# EAGLE design 2020-10-27 AD590 HIH-4031 (EAGLE 9.6.2)
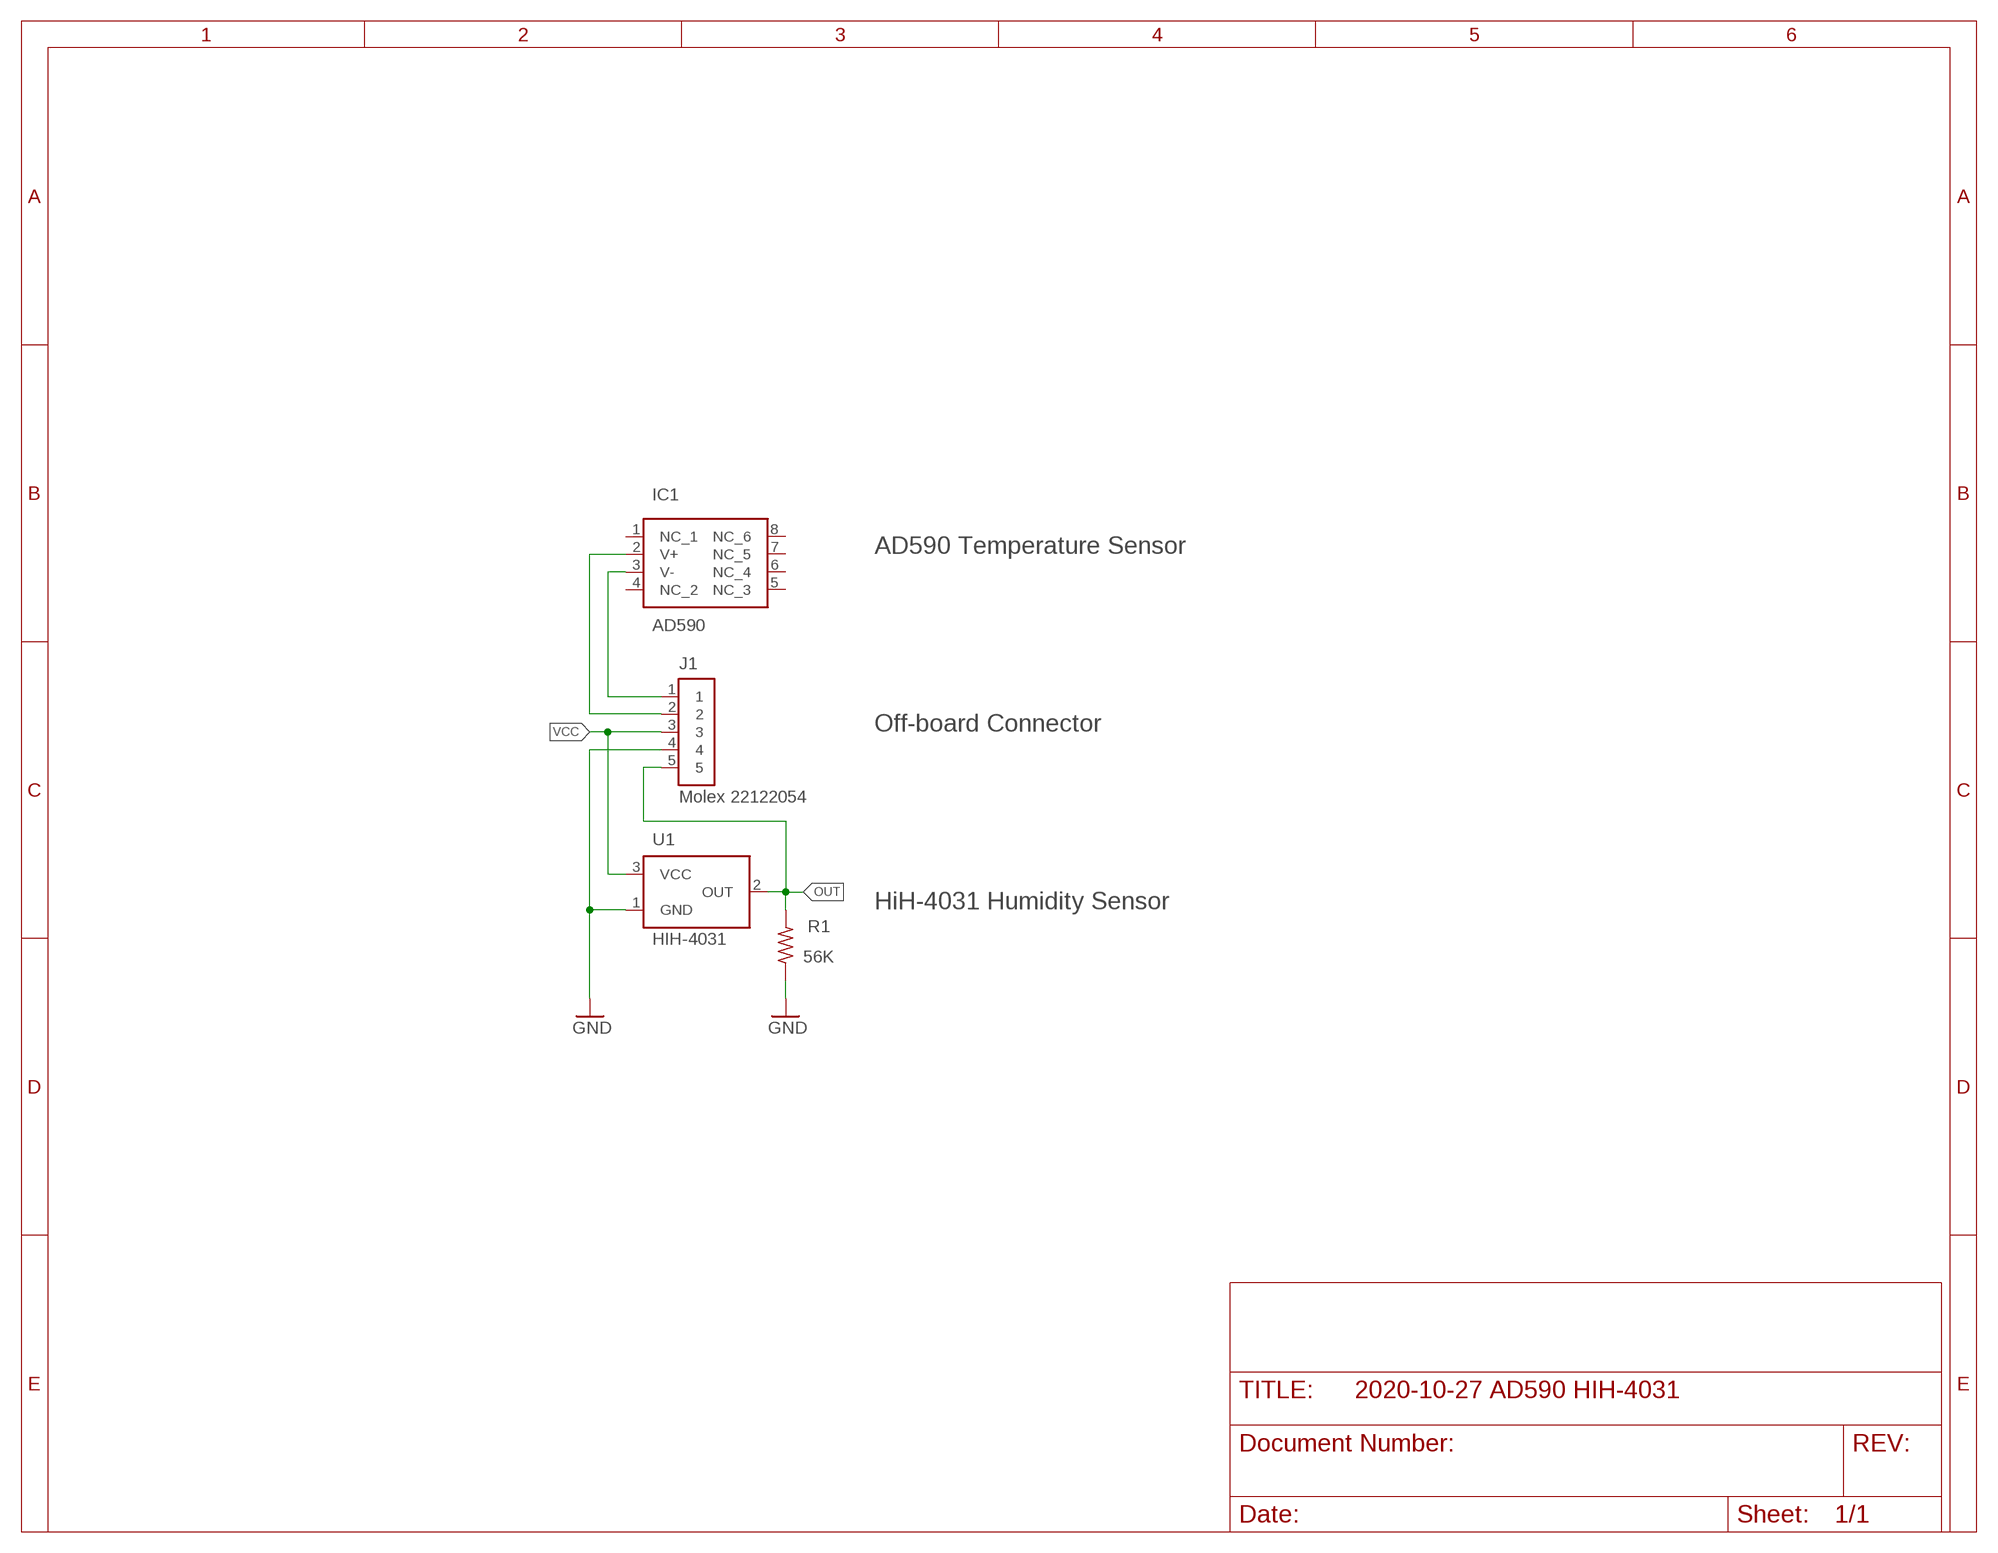
[diagram p0: schematic, sheet 1]

## Parts
IC1  AD590  AD590JRZ  [SOIC127P600X175-8N]
J1  Molex 22122054  PINHD-1X5RA-MOLEX-22122054  [1X05RA-MOLEX-22122054]
R1  56K  R-US_R0805  [R0805]
U1  HIH-4031  HIH-4030  [HIH-4030]

## Nets
GND: J1.4 R1.1 U1.1(GND)
OUT: J1.5 R1.2 U1.2(OUT)
V+: IC1.2(V+) J1.2
V-: IC1.3(V-) J1.1
VCC: J1.3 U1.3(VCC)
Unconnected: IC1.1(NC_1) IC1.4(NC_2) IC1.5(NC_3) IC1.6(NC_4) IC1.7(NC_5) IC1.8(NC_6)

## Notes on the sheet
- AD590 Temperature Sensor
- Off-board Connector
- HiH-4031 Humidity Sensor

## Library data of the parts
IC1 = AUmlib:AD590JRZ: AD590JRZ, Temperature Sensor +/-5C 4 to 30V 8-Pin SOIC Source: Datasheet <http://www.analog.com/static/imported-files/data_sheets/AD590.pdf>; DESCRIPTION: AD590JRZ, Temperature Sensor +/-5C 4 to 30V 8-Pin SOIC; HEIGHT: 1.75mm; MANUFACTURER_NAME: Analog Devices; MANUFACTURER_PART_NUMBER: AD590JRZ; MOUSER_PART_NUMBER: 584-AD590JRZ; MOUSER_PRICE-STOCK: https://www.mouser.com/Search/Refine.aspx?Keyword=584-AD590JRZ; RS_PART_NUMBER: 7096005P; RS_PRICE-STOCK: http://uk.rs-online.com/web/p/products/7096005P
J1 = AUmlib:PINHD-1X5RA-MOLEX-22122054
R1 = AUmlib:R-US_: RESISTOR, American symbol; SPICEPREFIX: R
U1 = AUmlib:HIH-4030: Honeywell HIH-4030 Humidity Sensor - Analog Output The HIH-4030/4031 Series delivers instrumentation-quality RH (Relative Humidity) sensing performance in a competitively priced, solderable SMD. Datasheet <https://www.sparkfun.com/datasheets/Sensors/Weather/SEN-09569-HIH-4030-datasheet.pdf> SparkFun Products SparkFun Humidity Sensor Breakout - HIH-4030 <https://www.sparkfun.com/products/9569> (SEN-09569); PROD_ID: IC-09448

## Board
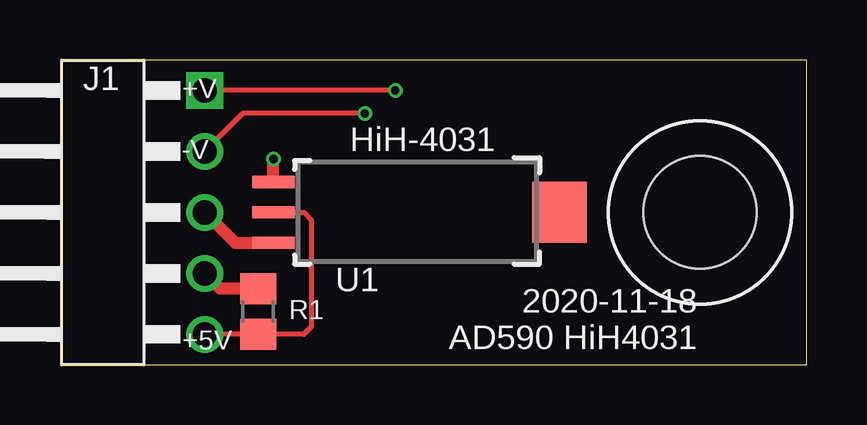
[diagram p1: board, top side]
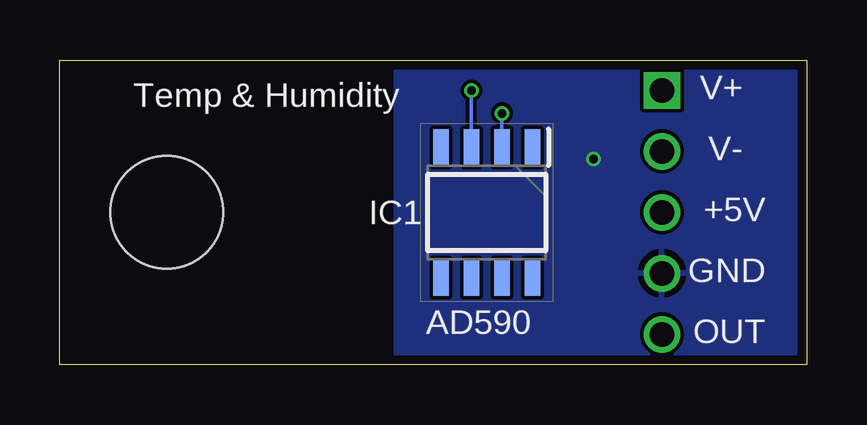
[diagram p2: board, bottom side, seen from below]

Size 31.11 x 12.7 mm. Coordinates in mm from the lower left corner, seen from the top.
Outline: 0,0 31.11,0 31.11,12.7 0,12.7 0,0
Copper layers (1*16): Top 0.035559375mm / dielectric 1.6mm / Bottom 0.035559375mm
Design rules "oshpark-2layer": minimum track width 6mil, minimum drill 10mil, track to track 6mil, track to pad 6mil, pad to pad 6mil, via to via 6mil, smd to smd 6mil, copper to edge 15mil, drill to drill 6mil, minimum pad ring 5mil, minimum via ring 5mil, stop-mask expansion 2.5mil, vias tented up to drill 0mil, thermal gap 10mil
Holes 4.7 mm at 26.67,6.35
bRestrict: area 22.9,2.5 to 30.5,10.2

### Footprints (pad centres in the part's own frame; a part is rotated, then mirrored left to right if it is on the bottom)
SOIC127P600X175-8N = smd 1.525 x 0.65: 1 -2.712,1.905; 2 -2.712,0.635; 3 -2.712,-0.635; 4 -2.712,-1.905; 5 2.712,-1.905; 6 2.712,-0.635; 7 2.712,0.635; 8 2.712,1.905
1X05RA-MOLEX-22122054 = drill 1.016 square: 1 -5.08,3.81 | drill 1.016: 2 -2.54,3.81; 3 0,3.81; 4 2.54,3.81; 5 5.08,3.81
R0805 = smd 1.3 x 1.5: 1 -0.95,0; 2 0.95,0
HIH-4030 = smd 0.508 x 1.778: 1 -1.27,-5.08; 2 0,-5.08; 3 1.27,-5.08 | smd 2.54 x 2.286: NC 0,6.842

### Placement (x,y rotation side)
IC1  13.34,6.35 270 bottom
J1  2.22,6.35 270 top
R1  8.26,2.22 270 top
U1  13.97,6.35 270 top

### Tracks (layer width: path | path; a pad name or v marks a point on that pad's centre or on a via)
GND  (via drill 0.35)
  Top 0.508: R1.1 6.67,3.17 J1.4 | U1.1 v8.89,8.57
  pour Bottom: 0,0 0,12.7 17.14,12.7 17.14,0
OUT
  Top 0.152: R1.2
  Top 0.203: U1.2 10.16,6.35 10.48,6.03 10.48,1.59 10.16,1.27 R1.2 | R1.2 J1.5
V+  (via drill 0.35)
  Top 0.203: v12.7,10.48 7.62,10.48 J1.2
  Bottom 0.152: IC1.2 v12.7,10.48
V-  (via drill 0.35)
  Top 0.203: v13.97,11.43 J1.1
  Bottom 0.152: IC1.3 v13.97,11.43
VCC
  Top 0.508: J1.3 7.3,5.08 U1.3

### Text on the board
tPlace: +V | -V | HiH-4031 | 2020-11-18 / AD590 HiH4031 | +5V
bPlace: V+ | Temp & Humidity | V- | +5V | GND | OUT | AD590